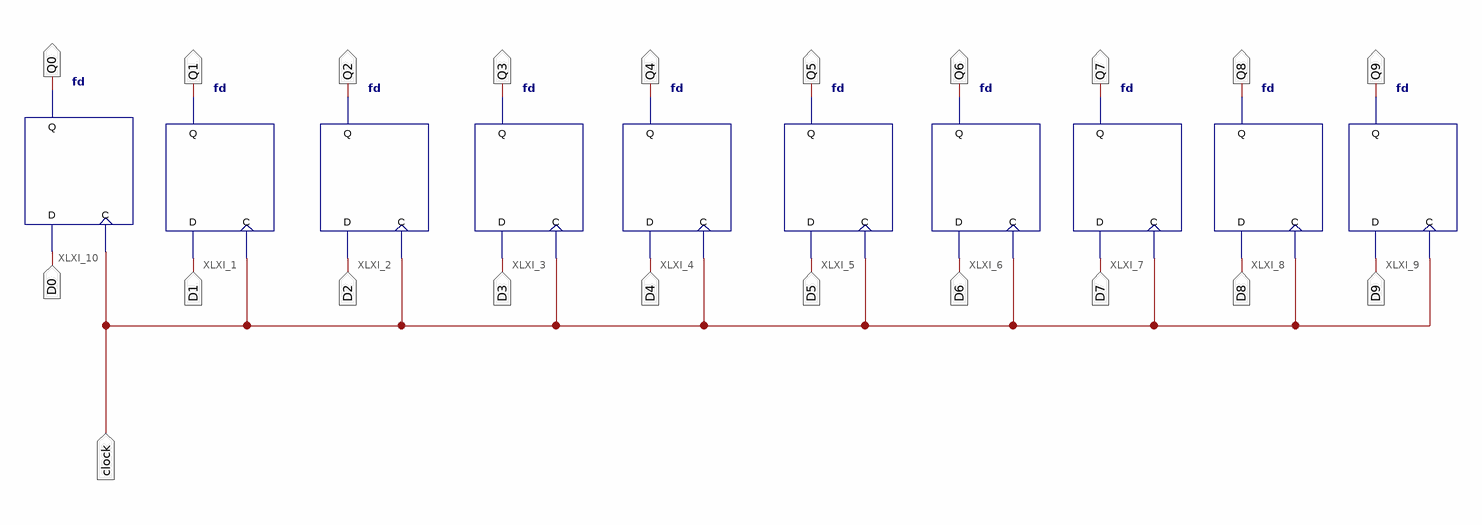
[diagram p0: schematic sheet 1]
// Xilinx ISE schematic Memory.sch (xc9500xl) as structural Verilog: 10 symbols, 21 ports
module Memory (
  input  clock,
  input  D0,
  input  D1,
  input  D2,
  input  D3,
  input  D4,
  input  D5,
  input  D6,
  input  D7,
  input  D8,
  input  D9,
  output Q0,
  output Q1,
  output Q2,
  output Q3,
  output Q4,
  output Q6,
  output Q7,
  output Q8,
  output Q9,
  output Q5
);

  fd XLXI_1 (.C(clock), .D(D1), .Q(Q1));
  fd XLXI_2 (.C(clock), .D(D2), .Q(Q2));
  fd XLXI_3 (.C(clock), .D(D3), .Q(Q3));
  fd XLXI_4 (.C(clock), .D(D4), .Q(Q4));
  fd XLXI_5 (.C(clock), .D(D5), .Q(Q5));
  fd XLXI_6 (.C(clock), .D(D6), .Q(Q6));
  fd XLXI_7 (.C(clock), .D(D7), .Q(Q7));
  fd XLXI_8 (.C(clock), .D(D8), .Q(Q8));
  fd XLXI_9 (.C(clock), .D(D9), .Q(Q9));
  fd XLXI_10 (.C(clock), .D(D0), .Q(Q0));
endmodule
